# EAGLE schematic ukl-eagle (EAGLE 6.5.0)
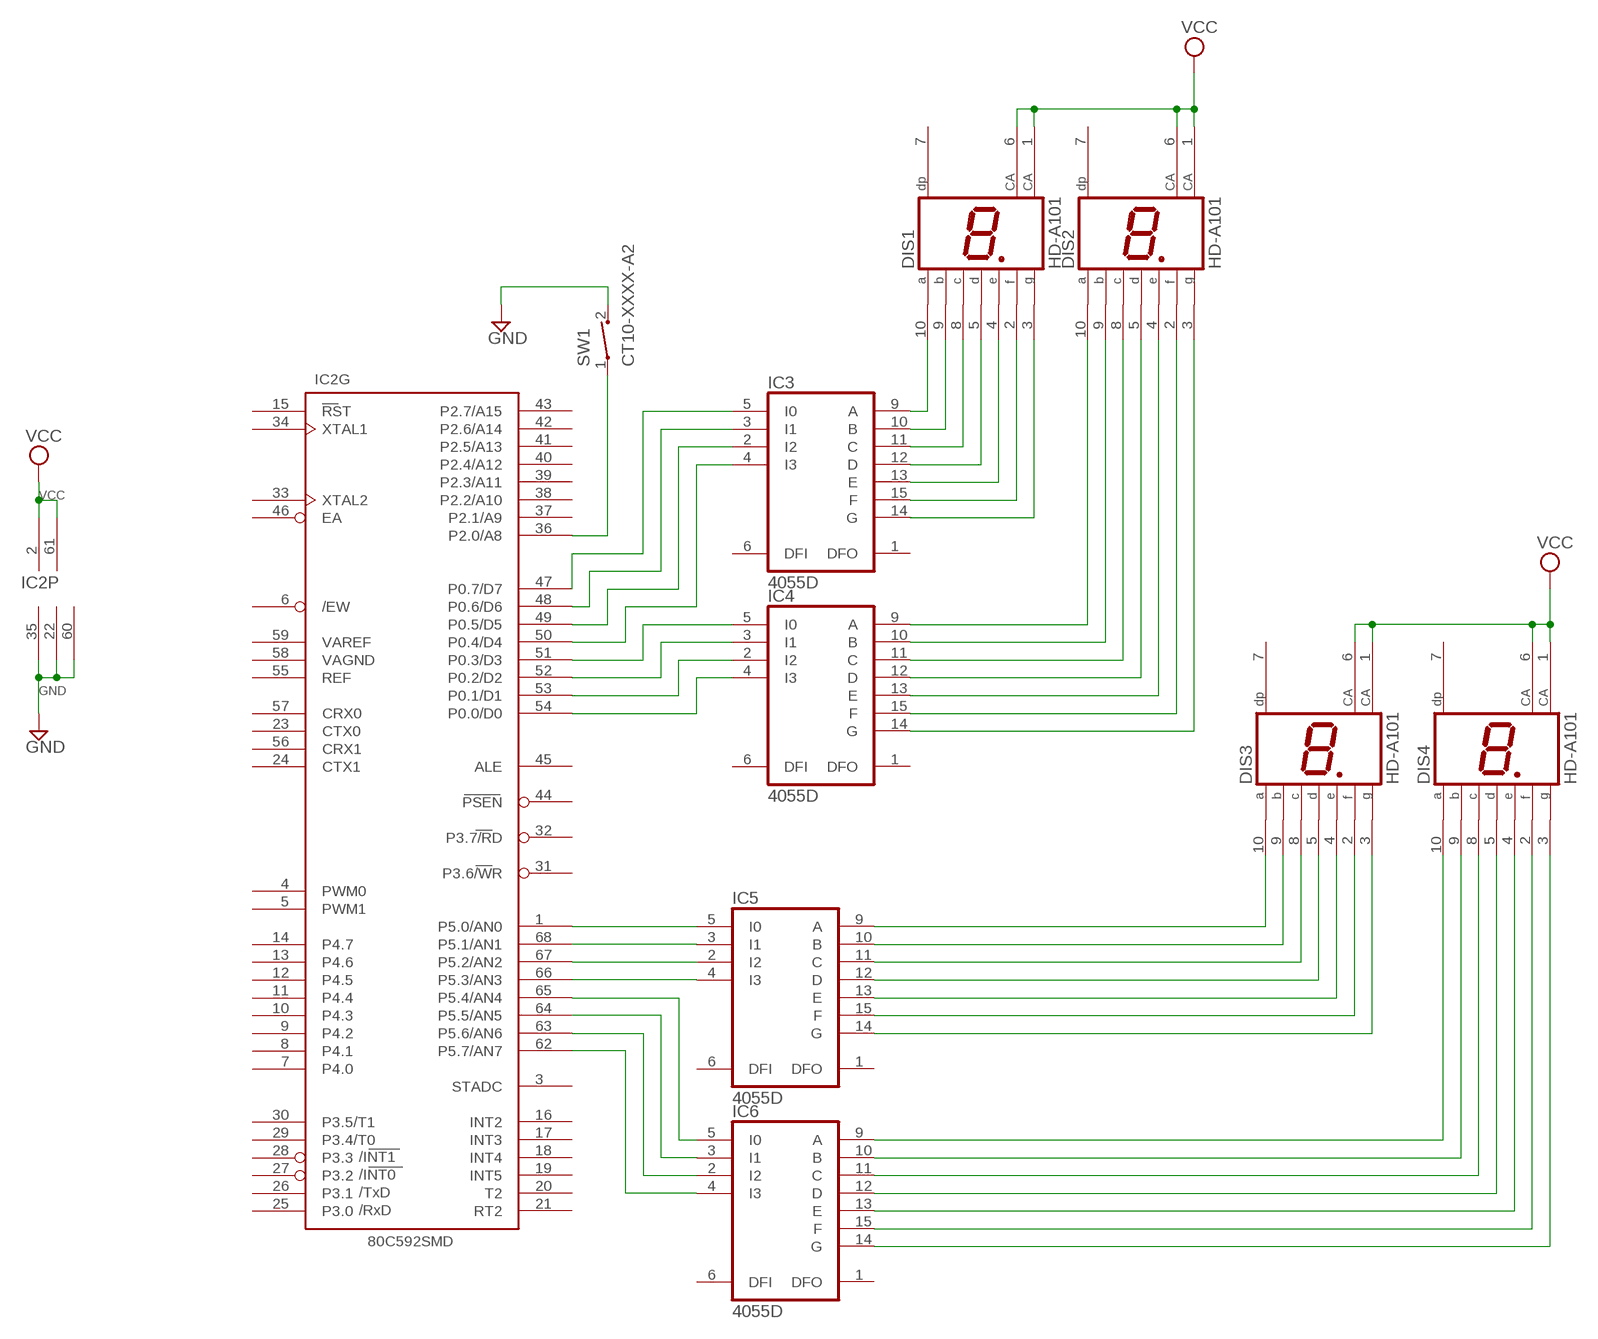
[diagram p0: schematic, sheet 1]

## Parts
DIS1  HD-A101  [HDSP-A]
DIS2  HD-A101  [HDSP-A]
DIS3  HD-A101  [HDSP-A]
DIS4  HD-A101  [HDSP-A]
IC2  80C592SMD  [PLCC68]
IC3  4055D  [SO16]
IC4  4055D  [SO16]
IC5  4055D  [SO16]
IC6  4055D  [SO16]
SW1  CT10-XXXX-A2  [CT10-XXXX-A2]

## Nets
GND: IC2.22(P:CGND) IC2.35(P:GND) IC2.60(P:AGND) SW1.2
N$1: DIS1.10(A) IC3.9(A)
N$2: DIS1.9(B) IC3.10(B)
N$3: DIS1.8(C) IC3.11(C)
N$4: DIS1.5(D) IC3.12(D)
N$5: DIS1.4(E) IC3.13(E)
N$6: DIS1.2(F) IC3.15(F)
N$7: DIS1.3(G) IC3.14(G)
N$8: DIS2.10(A) IC4.9(A)
N$9: DIS2.9(B) IC4.10(B)
N$10: DIS2.3(G) IC4.14(G)
N$11: DIS2.2(F) IC4.15(F)
N$12: DIS2.4(E) IC4.13(E)
N$13: DIS2.5(D) IC4.12(D)
N$14: DIS2.8(C) IC4.11(C)
N$15: DIS3.10(A) IC5.9(A)
N$16: DIS3.9(B) IC5.10(B)
N$17: DIS3.8(C) IC5.11(C)
N$18: DIS3.5(D) IC5.12(D)
N$19: DIS3.4(E) IC5.13(E)
N$20: DIS3.2(F) IC5.15(F)
N$21: DIS3.3(G) IC5.14(G)
N$22: DIS4.10(A) IC6.9(A)
N$23: DIS4.9(B) IC6.10(B)
N$24: DIS4.8(C) IC6.11(C)
N$25: DIS4.5(D) IC6.12(D)
N$26: DIS4.4(E) IC6.13(E)
N$27: DIS4.2(F) IC6.15(F)
N$28: DIS4.3(G) IC6.14(G)
N$29: IC2.54(G:P0.0/D0) IC4.4(I3)
N$30: IC2.53(G:P0.1/D1) IC4.2(I2)
N$31: IC2.52(G:P0.2/D2) IC4.3(I1)
N$32: IC2.51(G:P0.3/D3) IC4.5(I0)
N$33: IC2.50(G:P0.4/D4) IC3.4(I3)
N$34: IC2.49(G:P0.5/D5) IC3.2(I2)
N$35: IC2.48(G:P0.6/D6) IC3.3(I1)
N$37: IC2.47(G:P0.7/D7) IC3.5(I0)
N$38: IC2.36(G:P2.0/A8) SW1.1
N$39: IC2.1(G:P5.0/AN0) IC5.5(I0)
N$40: IC2.68(G:P5.1/AN1) IC5.3(I1)
N$41: IC2.67(G:P5.2/AN2) IC5.2(I2)
N$42: IC2.66(G:P5.3/AN3) IC5.4(I3)
N$43: IC2.65(G:P5.4/AN4) IC6.5(I0)
N$44: IC2.64(G:P5.5/AN5) IC6.3(I1)
N$45: IC2.63(G:P5.6/AN6) IC6.2(I2)
N$46: IC2.62(G:P5.7/AN7) IC6.4(I3)
VCC: DIS1.1(CA) DIS3.1(CA) DIS3.6(CA) DIS4.1(CA) DIS4.6(CA) IC2.2(P:VCC) IC2.61(P:AVCC)
Unconnected: DIS1.6(CA) DIS1.7(DP) DIS2.1(CA) DIS2.6(CA) DIS2.7(DP) DIS3.7(DP) DIS4.7(DP) IC2.3(G:STADC) IC2.4(G:PWM0) IC2.5(G:PWM1) IC2.6(G:/EW) IC2.7(G:P4.0) IC2.8(G:P4.1) IC2.9(G:P4.2) IC2.10(G:P4.3) IC2.11(G:P4.4) IC2.12(G:P4.5) IC2.13(G:P4.6) IC2.14(G:P4.7) IC2.15(G:RST) IC2.16(G:INT2) IC2.17(G:INT3) IC2.18(G:INT4) IC2.19(G:INT5) IC2.20(G:T2) IC2.21(G:RT2) IC2.23(G:CTX0) IC2.24(G:CTX1) IC2.25(G:P3.0) IC2.26(G:P3.1) IC2.27(G:P3.2) IC2.28(G:P3.3) IC2.29(G:P3.4/T0) IC2.30(G:P3.5/T1) IC2.31(G:P3.6/WR) IC2.32(G:P3.7/RD) IC2.33(G:XTAL2) IC2.34(G:XTAL1) IC2.37(G:P2.1/A9) IC2.38(G:P2.2/A10) IC2.39(G:P2.3/A11) IC2.40(G:P2.4/A12) IC2.41(G:P2.5/A13) IC2.42(G:P2.6/A14) IC2.43(G:P2.7/A15) IC2.44(G:PSEN) IC2.45(G:ALE) IC2.46(G:EA) IC2.55(G:REF) IC2.56(G:CRX1) IC2.57(G:CRX0) IC2.58(G:VAGND) IC2.59(G:VAREF) IC3.1(DFO) IC3.6(DFI) IC4.1(DFO) IC4.6(DFI) IC5.1(DFO) IC5.6(DFI) IC6.1(DFO) IC6.6(DFI)

## Power pins joined to a net without a drawn wire
GND: IC3.8(GND) IC4.8(GND) IC5.8(GND) IC6.8(GND)
VCC: IC3.16(VCC) IC4.16(VCC) IC5.16(VCC) IC6.16(VCC)
VEE: IC3.7(VEE) IC4.7(VEE) IC5.7(VEE) IC6.7(VEE)

## Library data of the parts
DIS1-DIS4 = display-hp:HD-A101: LED DISPLAY 1-character 7 segment, decimal point right; OC_FARNELL: unknown; OC_NEWARK: unknown
IC2 = micro-philips:80C592: 8051 -compatible 8bit Microcontroller CAN 2.0A; MPN: P80C592FFA/00,512; OC_FARNELL: 1085276; OC_NEWARK: 70R8453
IC3-IC6 = 40xx:4055: BCD to 7-segment LCD DRIVER
SW1 = switch-coto:CT10-XXXX-: CT10 Series Molded Switch Source: www.cotorelay.com .. Coto_Technology__CT10-1530-G1.pdf